# Altium project GE-Switch.PrjPCB
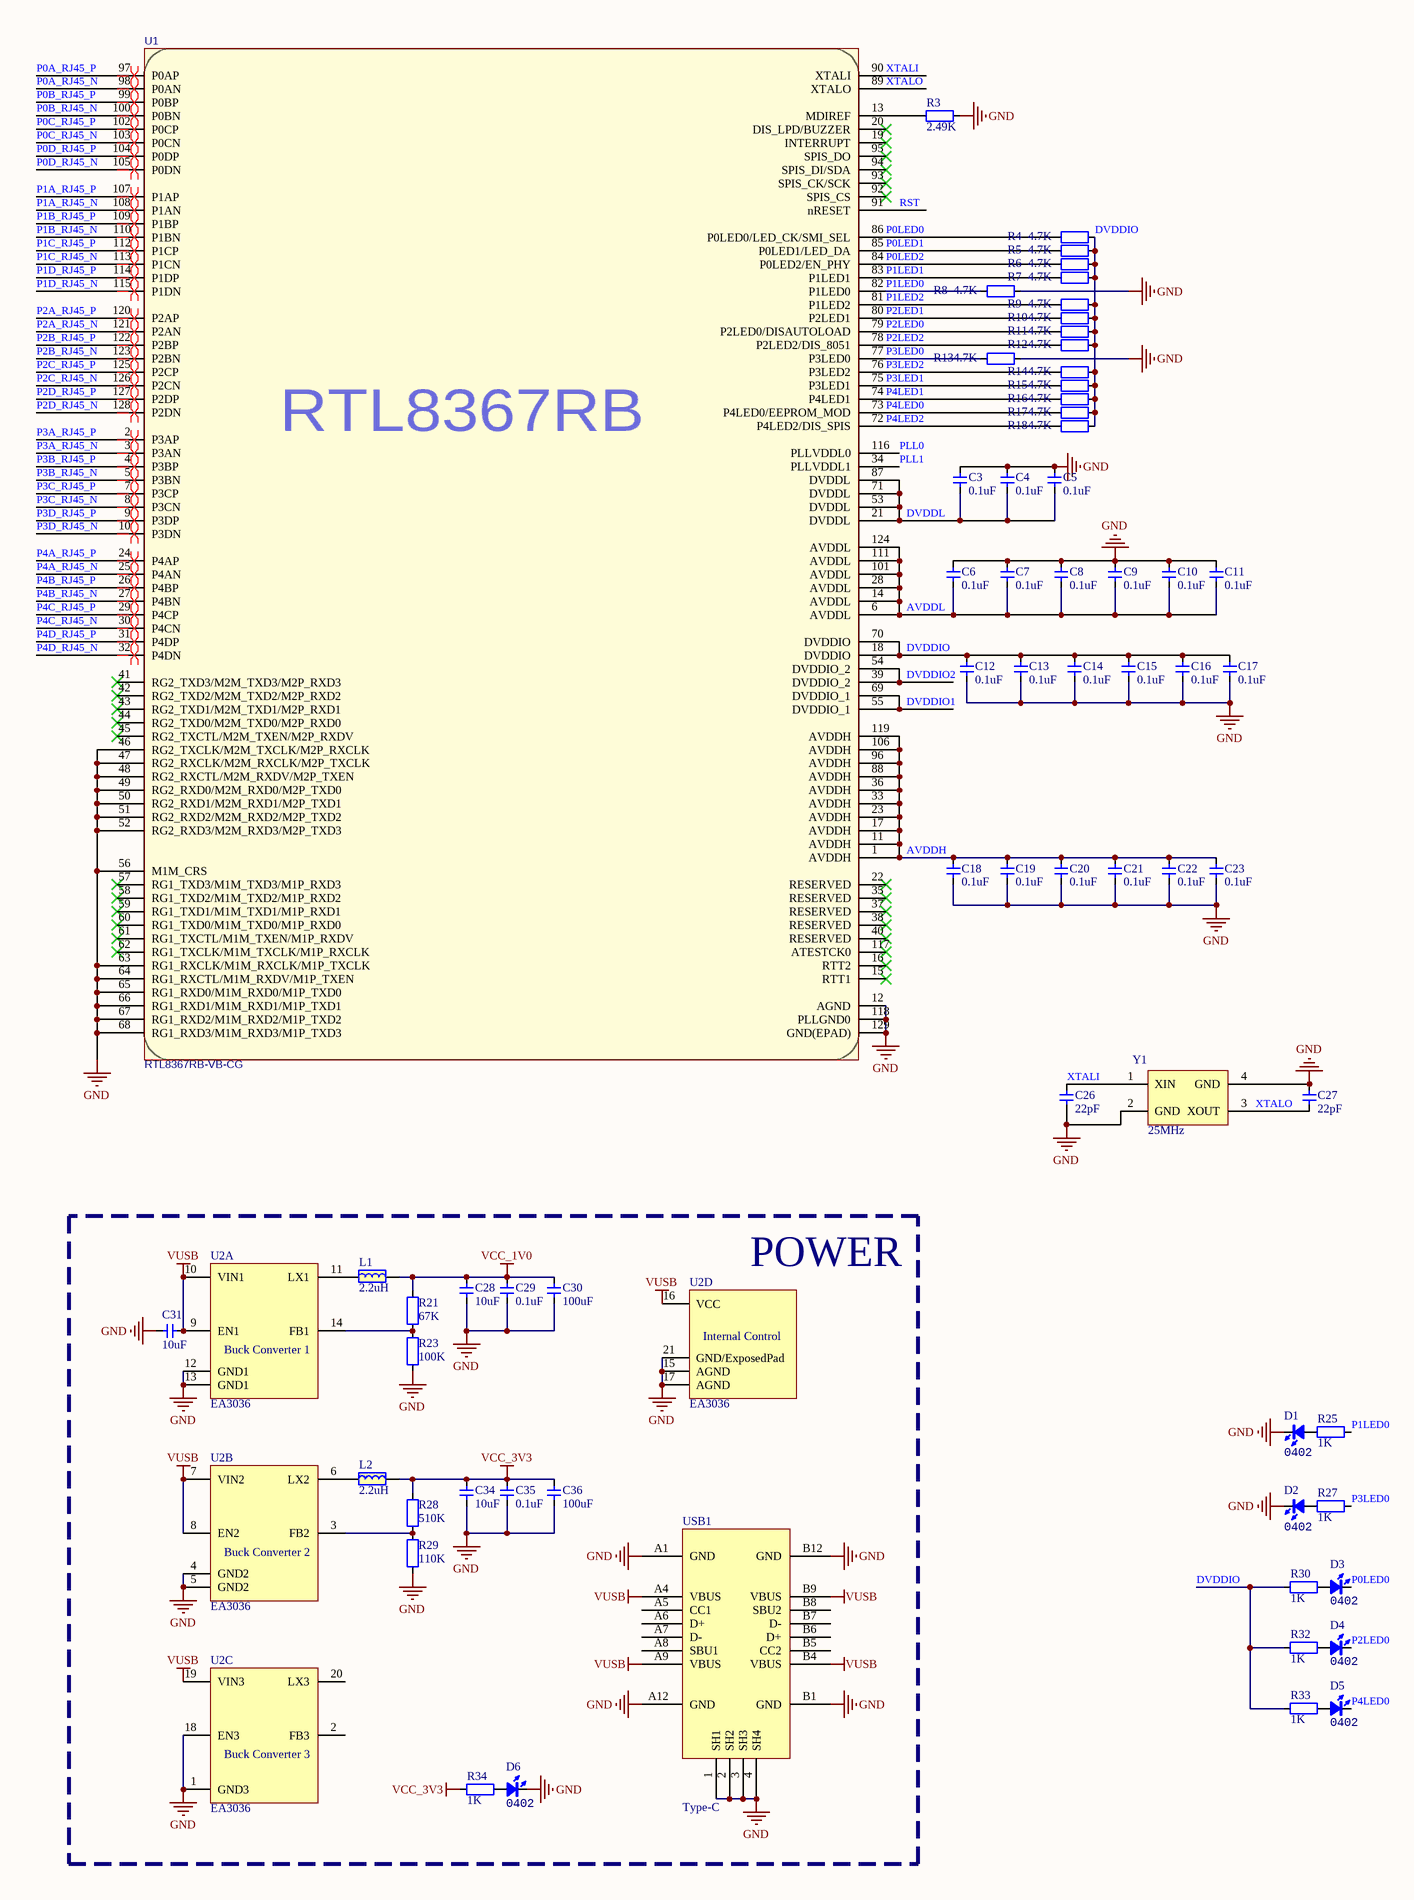
[diagram p0: Main.SchDoc, left]
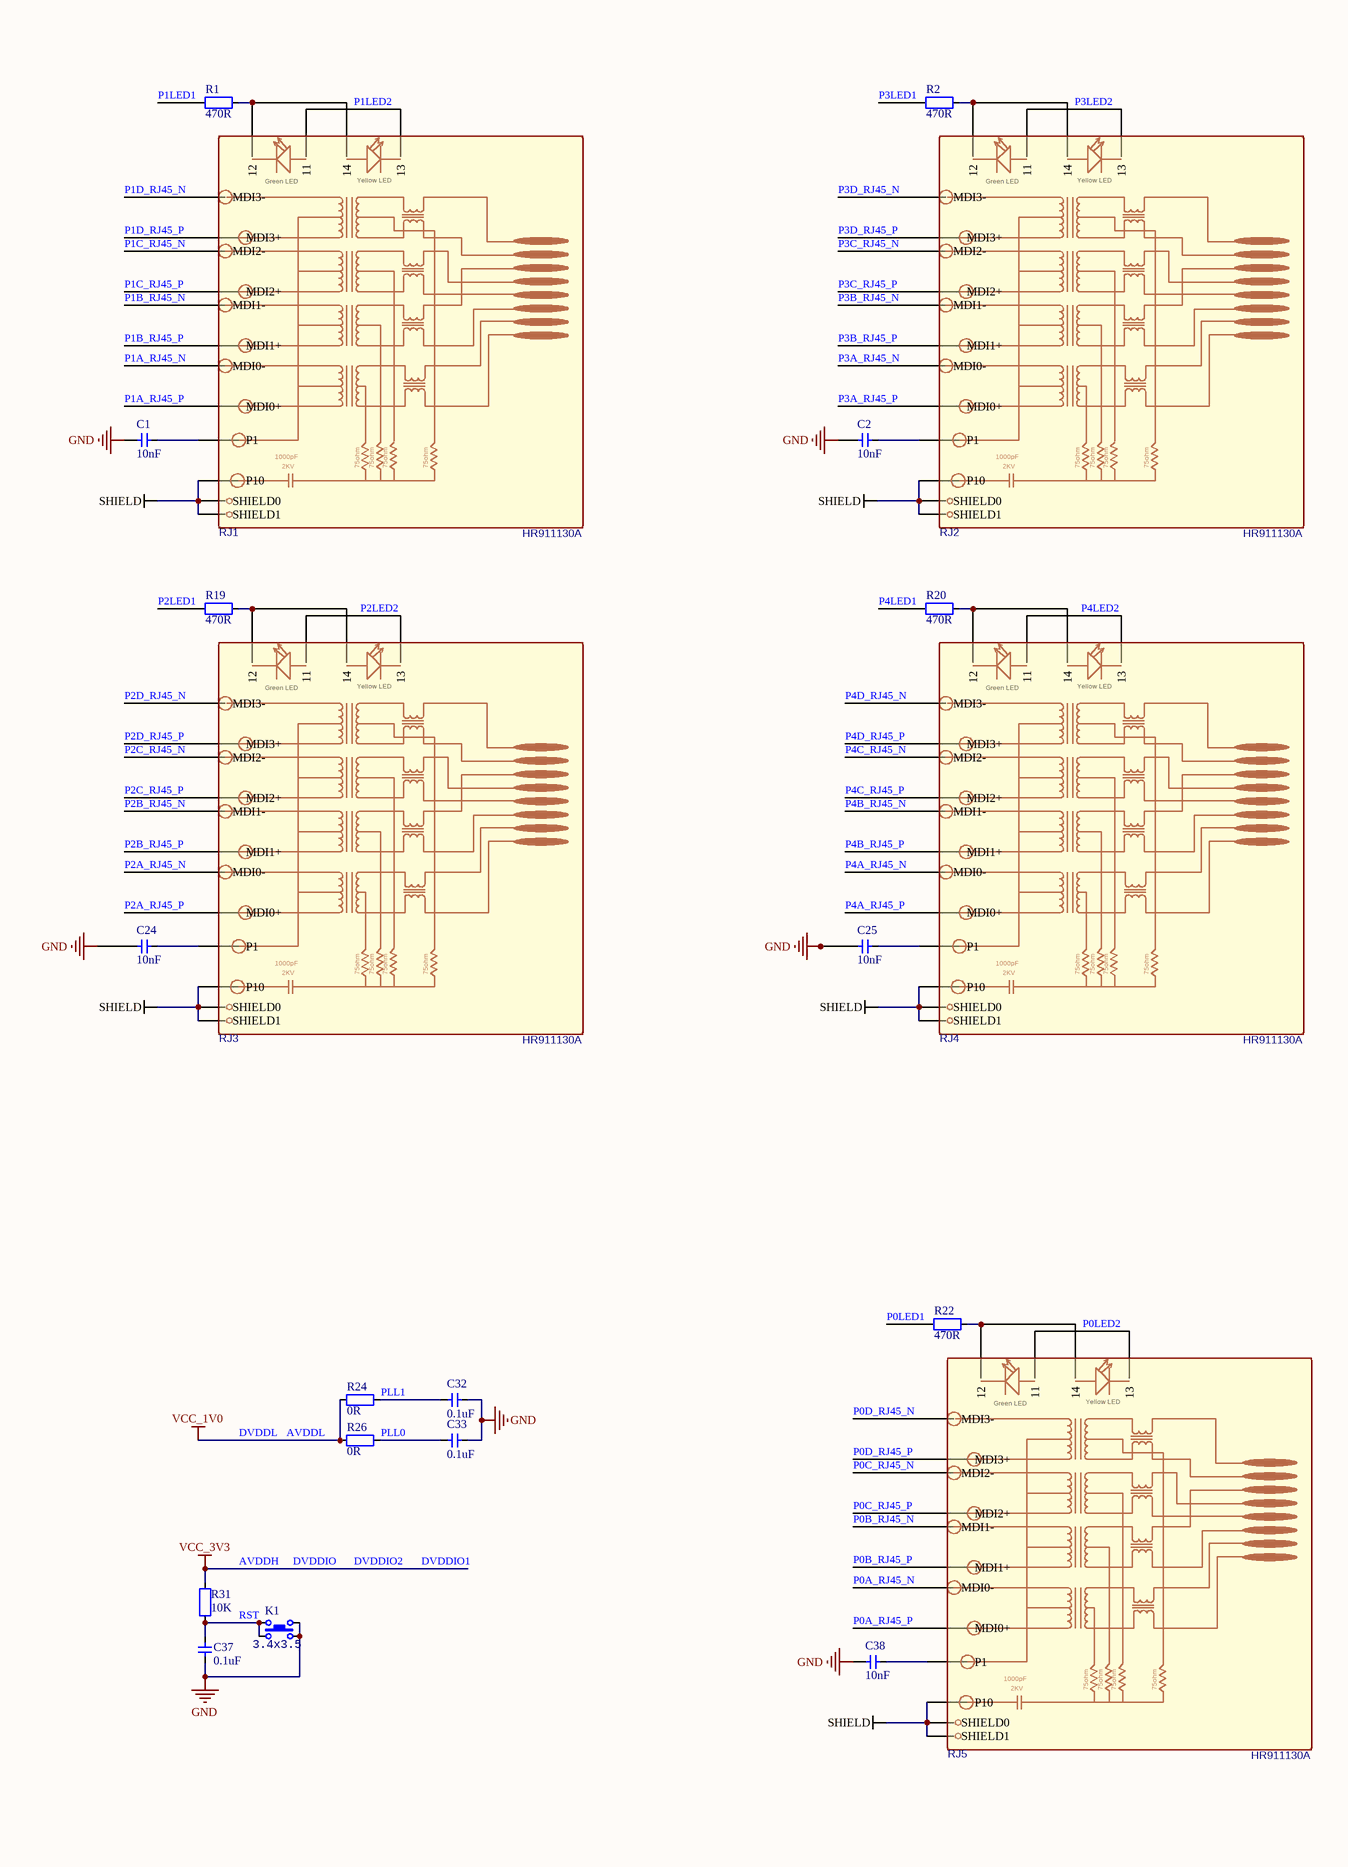
[diagram p1: Main.SchDoc, right]
1 sheet, 90 parts. Net scope: global (net labels, ports and power ports of the same name join across sheets).
Board file: GE-Switch.PcbDoc

## Sheet Main.SchDoc
size A2; SheetNumber: 1; SheetTotal: 1

### Parts
C1  10nF  [CAP_0402]
C2  10nF  [CAP_0402]
C3  0.1uF  [CAP_0402]
C4  0.1uF  [CAP_0402]
C5  0.1uF  [CAP_0402]
C6  0.1uF  [CAP_0402]
C7  0.1uF  [CAP_0402]
C8  0.1uF  [CAP_0402]
C9  0.1uF  [CAP_0402]
C10  0.1uF  [CAP_0402]
C11  0.1uF  [CAP_0402]
C12  0.1uF  [CAP_0402]
C13  0.1uF  [CAP_0402]
C14  0.1uF  [CAP_0402]
C15  0.1uF  [CAP_0402]
C16  0.1uF  [CAP_0402]
C17  0.1uF  [CAP_0402]
C18  0.1uF  [CAP_0402]
C19  0.1uF  [CAP_0402]
C20  0.1uF  [CAP_0402]
C21  0.1uF  [CAP_0402]
C22  0.1uF  [CAP_0402]
C23  0.1uF  [CAP_0402]
C24  10nF  [CAP_0402]
C25  10nF  [CAP_0402]
C26  22pF  [CAP_0402]
C27  22pF  [CAP_0402]
C28  10uF  [CAP_0402]
C29  0.1uF  [CAP_0402]
C30  100uF  [1206-CAP]
C31  10uF  [CAP_0402]
C32  0.1uF  [CAP_0402]
C33  0.1uF  [CAP_0402]
C34  10uF  [CAP_0402]
C35  0.1uF  [CAP_0402]
C36  100uF  [1206-CAP]
C37  0.1uF  [CAP_0402]
C38  10nF  [CAP_0402]
D1  Type: 0402  [LED_0402_RED]  (hidden comment: color?)
D2  Type: 0402  [LED_0402_RED]  (hidden comment: color?)
D3  Type: 0402  [LED_0402_RED]  (hidden comment: color?)
D4  Type: 0402  [LED_0402_RED]  (hidden comment: color?)
D5  Type: 0402  [LED_0402_RED]  (hidden comment: color?)
D6  Type: 0402  [LED_0402_RED]  (hidden comment: color?)
K1  value 3.4x3.5  [ButtonTACT_3.5*3.55_90]  (hidden comment: TACT 4P)
L1  2.2uH  [2520-L]
L2  2.2uH  [2520-L]
R1  470R  [RES_0402]
R2  470R  [RES_0402]
R3  2.49K  [RES_0402]
R4  4.7K  [RES_0402]
R5  4.7K  [RES_0402]
R6  4.7K  [RES_0402]
R7  4.7K  [RES_0402]
R8  4.7K  [RES_0402]
R9  4.7K  [RES_0402]
R10  4.7K  [RES_0402]
R11  4.7K  [RES_0402]
R12  4.7K  [RES_0402]
R13  4.7K  [RES_0402]
R14  4.7K  [RES_0402]
R15  4.7K  [RES_0402]
R16  4.7K  [RES_0402]
R17  4.7K  [RES_0402]
R18  4.7K  [RES_0402]
R19  470R  [RES_0402]
R20  470R  [RES_0402]
R21  67K  [RES_0402]
R22  470R  [RES_0402]
R23  100K  [RES_0402]
R24  0R  [RES_0402]
R25  1K  [RES_0402]
R26  0R  [RES_0402]
R27  1K  [RES_0402]
R28  510K  [RES_0402]
R29  110K  [RES_0402]
R30  1K  [RES_0402]
R31  10K  [RES_0402]
R32  1K  [RES_0402]
R33  1K  [RES_0402]
R34  1K  [RES_0402]
RJ1  HR911130A  [RJ45-TH_HR911130A]
RJ2  HR911130A  [RJ45-TH_HR911130A]
RJ3  HR911130A  [RJ45-TH_HR911130A]
RJ4  HR911130A  [RJ45-TH_HR911130A]
RJ5  HR911130A  [RJ45-TH_HR911130A]
U1  RTL8367RB-VB-CG  [LQFP-128]
U2  EA3036  [QFN-20]  (parts A,B,C,D of 4)
USB1  Type-C  [Type-C-TOP]
Y1  25MHz  [晶振2520]

### Blocks framed on the sheet
POWER: C28-C31 C34-C36 D6 L1 L2 R21 R23 R28 R29 R34 U2 USB1

### Nets
AVDDH: C12.1 C13.1 C14.1 C15.1 C16.1 C17.1 C18.1 C19.1 C20.1 C21.1 C22.1 C23.1 C34.1 C35.1 C36.2 L2.2 R4.2 R5.2 R6.2 R7.2 R9.2 R10.2 R11.2 R12.2 R14.2 R15.2 R16.2 R17.2 R18.2 R28.2 R30.1 R31.2 R32.1 R33.1 R34.1 U1.1(AVDDH) U1.11(AVDDH) U1.17(AVDDH) U1.18(DVDDIO) U1.23(AVDDH) U1.33(AVDDH) U1.36(AVDDH) U1.39(DVDDIO_2) U1.54(DVDDIO_2) U1.55(DVDDIO_1) U1.69(DVDDIO_1) U1.70(DVDDIO) U1.88(AVDDH) U1.96(AVDDH) U1.106(AVDDH) U1.119(AVDDH)  [also labelled DVDDIO, DVDDIO1, DVDDIO2, VCC_3V3]
AVDDL: C3.2 C4.2 C5.2 C6.2 C7.2 C8.2 C9.2 C10.2 C11.2 C28.1 C29.1 C30.2 L1.2 R21.2 R24.2 R26.2 U1.6(AVDDL) U1.14(AVDDL) U1.21(DVDDL) U1.28(AVDDL) U1.53(DVDDL) U1.71(DVDDL) U1.87(DVDDL) U1.101(AVDDL) U1.111(AVDDL) U1.124(AVDDL)  [also labelled DVDDL, VCC_1V0]
GND: C1.1 C2.1 C3.1 C4.1 C5.1 C6.1 C7.1 C8.1 C9.1 C10.1 C11.1 C12.2 C13.2 C14.2 C15.2 C16.2 C17.2 C18.2 C19.2 C20.2 C21.2 C22.2 C23.2 C24.1 C25.1 C26.1 C27.1 C28.2 C29.2 C30.1 C31.1 C32.2 C33.2 C34.2 C35.2 C36.1 C37.2 C38.1 D1.2(K) D2.2(K) D6.2(K) K1.2 K1.4 R3.2 R8.2 R13.2 R23.1 R29.1 U1.12(AGND) U1.46(RG2_TXCLK/M2M_TXCLK/M2P_RXCLK) U1.47(RG2_RXCLK/M2M_RXCLK/M2P_TXCLK) U1.48(RG2_RXCTL/M2M_RXDV/M2P_TXEN) U1.49(RG2_RXD0/M2M_RXD0/M2P_TXD0) U1.50(RG2_RXD1/M2M_RXD1/M2P_TXD1) U1.51(RG2_RXD2/M2M_RXD2/M2P_TXD2) U1.52(RG2_RXD3/M2M_RXD3/M2P_TXD3) U1.56(M1M_CRS) U1.63(RG1_RXCLK/M1M_RXCLK/M1P_TXCLK) U1.64(RG1_RXCTL/M1M_RXDV/M1P_TXEN) U1.65(RG1_RXD0/M1M_RXD0/M1P_TXD0) U1.66(RG1_RXD1/M1M_RXD1/M1P_TXD1) U1.67(RG1_RXD2/M1M_RXD2/M1P_TXD2) U1.68(RG1_RXD3/M1M_RXD3/M1P_TXD3) U1.118(PLLGND0) U1.129(GND(EPAD)) U2.1(GND3) U2.4(GND2) U2.5(GND2) U2.12(GND1) U2.13(GND1) U2.15(AGND) U2.17(AGND) U2.18(EN3) U2.21(GND/ExposedPad) USB1.1(SH1) USB1.2(SH2) USB1.3(SH3) USB1.4(SH4) USB1.A1(GND) USB1.A12(GND) USB1.B1(GND) USB1.B12(GND) Y1.2(GND) Y1.4(GND)
SHIELD: RJ1.P10 RJ1.SHIELD0 RJ1.SHIELD1 RJ2.P10 RJ2.SHIELD0 RJ2.SHIELD1 RJ3.P10 RJ3.SHIELD0 RJ3.SHIELD1 RJ4.P10 RJ4.SHIELD0 RJ4.SHIELD1 RJ5.P10 RJ5.SHIELD0 RJ5.SHIELD1
VUSB: C31.2 U2.7(VIN2) U2.8(EN2) U2.9(EN1) U2.10(VIN1) U2.16(VCC) U2.19(VIN3) USB1.A4(VBUS) USB1.A9(VBUS) USB1.B4(VBUS) USB1.B9(VBUS)
P0A_RJ45_N: RJ5.P3(MDI0-) U1.98(P0AN)
P0A_RJ45_P: RJ5.P2(MDI0+) U1.97(P0AP)
P0B_RJ45_N: RJ5.P7(MDI1-) U1.100(P0BN)
P0B_RJ45_P: RJ5.P4(MDI1+) U1.99(P0BP)
P0C_RJ45_N: RJ5.P6(MDI2-) U1.103(P0CN)
P0C_RJ45_P: RJ5.P5(MDI2+) U1.102(P0CP)
P0D_RJ45_N: RJ5.P9(MDI3-) U1.105(P0DN)
P0D_RJ45_P: RJ5.P8(MDI3+) U1.104(P0DP)
P0LED0: D3.2(K) R4.1 U1.86(P0LED0/LED_CK/SMI_SEL)
P0LED1: R5.1 R22.1 U1.85(P0LED1/LED_DA)
P0LED2: R6.1 RJ5.11 RJ5.13 U1.84(P0LED2/EN_PHY)
P1A_RJ45_N: RJ1.P3(MDI0-) U1.108(P1AN)
P1A_RJ45_P: RJ1.P2(MDI0+) U1.107(P1AP)
P1B_RJ45_N: RJ1.P7(MDI1-) U1.110(P1BN)
P1B_RJ45_P: RJ1.P4(MDI1+) U1.109(P1BP)
P1C_RJ45_N: RJ1.P6(MDI2-) U1.113(P1CN)
P1C_RJ45_P: RJ1.P5(MDI2+) U1.112(P1CP)
P1D_RJ45_N: RJ1.P9(MDI3-) U1.115(P1DN)
P1D_RJ45_P: RJ1.P8(MDI3+) U1.114(P1DP)
P1LED0: R8.1 R25.1 U1.82(P1LED0)
P1LED1: R1.1 R7.1 U1.83(P1LED1)
P1LED2: R9.1 RJ1.11 RJ1.13 U1.81(P1LED2)
P2A_RJ45_N: RJ3.P3(MDI0-) U1.121(P2AN)
P2A_RJ45_P: RJ3.P2(MDI0+) U1.120(P2AP)
P2B_RJ45_N: RJ3.P7(MDI1-) U1.123(P2BN)
P2B_RJ45_P: RJ3.P4(MDI1+) U1.122(P2BP)
P2C_RJ45_N: RJ3.P6(MDI2-) U1.126(P2CN)
P2C_RJ45_P: RJ3.P5(MDI2+) U1.125(P2CP)
P2D_RJ45_N: RJ3.P9(MDI3-) U1.128(P2DN)
P2D_RJ45_P: RJ3.P8(MDI3+) U1.127(P2DP)
P2LED0: D4.2(K) R11.1 U1.79(P2LED0/DISAUTOLOAD)
P2LED1: R10.1 R19.1 U1.80(P2LED1)
P2LED2: R12.1 RJ3.11 RJ3.13 U1.78(P2LED2/DIS_8051)
P3A_RJ45_N: RJ2.P3(MDI0-) U1.3(P3AN)
P3A_RJ45_P: RJ2.P2(MDI0+) U1.2(P3AP)
P3B_RJ45_N: RJ2.P7(MDI1-) U1.5(P3BN)
P3B_RJ45_P: RJ2.P4(MDI1+) U1.4(P3BP)
P3C_RJ45_N: RJ2.P6(MDI2-) U1.8(P3CN)
P3C_RJ45_P: RJ2.P5(MDI2+) U1.7(P3CP)
P3D_RJ45_N: RJ2.P9(MDI3-) U1.10(P3DN)
P3D_RJ45_P: RJ2.P8(MDI3+) U1.9(P3DP)
P3LED0: R13.1 R27.1 U1.77(P3LED0)
P3LED1: R2.1 R15.1 U1.75(P3LED1)
P3LED2: R14.1 RJ2.11 RJ2.13 U1.76(P3LED2)
P4A_RJ45_N: RJ4.P3(MDI0-) U1.25(P4AN)
P4A_RJ45_P: RJ4.P2(MDI0+) U1.24(P4AP)
P4B_RJ45_N: RJ4.P7(MDI1-) U1.27(P4BN)
P4B_RJ45_P: RJ4.P4(MDI1+) U1.26(P4BP)
P4C_RJ45_N: RJ4.P6(MDI2-) U1.30(P4CN)
P4C_RJ45_P: RJ4.P5(MDI2+) U1.29(P4CP)
P4D_RJ45_N: RJ4.P9(MDI3-) U1.32(P4DN)
P4D_RJ45_P: RJ4.P8(MDI3+) U1.31(P4DP)
P4LED0: D5.2(K) R17.1 U1.73(P4LED0/EEPROM_MOD)
P4LED1: R16.1 R20.1 U1.74(P4LED1)
P4LED2: R18.1 RJ4.11 RJ4.13 U1.72(P4LED2/DIS_SPIS)
PLL0: C33.1 R26.1 U1.116(PLLVDDL0)
PLL1: C32.1 R24.1 U1.34(PLLVDDL1)
RST: C37.1 K1.1 K1.3 R31.1 U1.91(nRESET)
XTALI: C26.2 U1.90(XTALI) Y1.1(XIN)
XTALO: C27.2 U1.89(XTALO) Y1.3(XOUT)
NetC1_2: C1.2 RJ1.P1
NetC2_2: C2.2 RJ2.P1
NetC24_2: C24.2 RJ3.P1
NetC25_2: C25.2 RJ4.P1
NetC38_2: C38.2 RJ5.P1
NetD1_1: D1.1(A) R25.2
NetD2_1: D2.1(A) R27.2
NetD3_1: D3.1(A) R30.2
NetD4_1: D4.1(A) R32.2
NetD5_1: D5.1(A) R33.2
NetD6_1: D6.1(A) R34.2
NetL1_1: L1.1 U2.11(LX1)
NetL2_1: L2.1 U2.6(LX2)
NetR1_2: R1.2 RJ1.12 RJ1.14
NetR2_2: R2.2 RJ2.12 RJ2.14
NetR3_1: R3.1 U1.13(MDIREF)
NetR19_2: R19.2 RJ3.12 RJ3.14
NetR20_2: R20.2 RJ4.12 RJ4.14
NetR21_1: R21.1 R23.2 U2.14(FB1)
NetR22_2: R22.2 RJ5.12 RJ5.14
NetR28_1: R28.1 R29.2 U2.3(FB2)

Not connected (* = marked no-connect by the designer): U1 15(RTT1)* 16(RTT2)* 19(INTERRUPT)* 20(DIS_LPD/BUZZER)* 22(RESERVED)* 35(RESERVED)* 37(RESERVED)* 38(RESERVED)* 40(RESERVED)* 41(RG2_TXD3/M2M_TXD3/M2P_RXD3)* 42(RG2_TXD2/M2M_TXD2/M2P_RXD2)* 43(RG2_TXD1/M2M_TXD1/M2P_RXD1)* 44(RG2_TXD0/M2M_TXD0/M2P_RXD0)* 45(RG2_TXCTL/M2M_TXEN/M2P_RXDV)* 57(RG1_TXD3/M1M_TXD3/M1P_RXD3)* 58(RG1_TXD2/M1M_TXD2/M1P_RXD2)* 59(RG1_TXD1/M1M_TXD1/M1P_RXD1)* 60(RG1_TXD0/M1M_TXD0/M1P_RXD0)* 61(RG1_TXCTL/M1M_TXEN/M1P_RXDV)* 62(RG1_TXCLK/M1M_TXCLK/M1P_RXCLK)* 92(SPIS_CS)* 93(SPIS_CK/SCK)* 94(SPIS_DI/SDA)* 95(SPIS_DO)* 117(ATESTCK0)*; U2 2(FB3) 20(LX3); USB1 A5(CC1) A6(D+) A7(D-) A8(SBU1) B5(CC2) B6(D+) B7(D-) B8(SBU2)

### Layout directives
differential pair: P0A_RJ45_N, P0A_RJ45_P, P0B_RJ45_N, P0B_RJ45_P, P0C_RJ45_N, P0C_RJ45_P, P0D_RJ45_N, P0D_RJ45_P, P1A_RJ45_N, P1A_RJ45_P, P1B_RJ45_N, P1B_RJ45_P, P1C_RJ45_N, P1C_RJ45_P, P1D_RJ45_N, P1D_RJ45_P, P2A_RJ45_N, P2A_RJ45_P, P2B_RJ45_N, P2B_RJ45_P, P2C_RJ45_N, P2C_RJ45_P, P2D_RJ45_N, P2D_RJ45_P, P3A_RJ45_N, P3A_RJ45_P, P3B_RJ45_N, P3B_RJ45_P, P3C_RJ45_N, P3C_RJ45_P, P3D_RJ45_N, P3D_RJ45_P, P4A_RJ45_N, P4A_RJ45_P, P4B_RJ45_N, P4B_RJ45_P, P4C_RJ45_N, P4C_RJ45_P, P4D_RJ45_N, P4D_RJ45_P

### Notes on the sheet
- (in symbol EA3036, part A) Buck Converter 1
- (in symbol EA3036, part B) Buck Converter 2
- (in symbol EA3036, part C) Buck Converter 3
- (in symbol EA3036, part D) Internal Control
- (in symbol HR911130A) Yellow LED; Green LED; J8; J7; J6 RX-; J5; J4; J3 RX+; J2 TX-; J1 TX+; 1000pF; 75ohm; 2KV
- (in symbol RTL8367RB-VB-CG) RTL8367RB

### Library data of the parts
C1-C29 C31-C35 C37 C38 = 电容-0402: Capacitor; Value: 0.1u
C30 C36 = 电容-1206: Capacitor; Value: 0.1u
D1-D6 = LED_0402: LED; Value: color?
K1 = ButtonTACT: Button; type: TACT 4P
L1 L2 = 电感-2520: 磁珠
R1-R34 = 电阻-0402: Resistor; Value: 22R
RJ1-RJ5 = HR911130A: BOM_Manufacturer: HANRUN; BOM_Supplier: LCSC; BOM_Manufacturer Part: HR911130A; BOM_Supplier Part: C54408; spicePre: R; spiceSymbolName: HR911130A
U1 = RTL8367RB-VB-CG: Contributor: libc0607; link: https://www.realtek.com/en/products/communications-network-ics/item/rtl8367rb-vb-cg; spicePre: U; spiceSymbolName: RTL8367RB-VB-CG
U2 = EA3036: EA3036 is a 3CH power management IC for applications powered by one Li-Ion battery or a DC 5V adapter.
USB1 = USB-Type-C-TOP
Y1 = 晶振-4Pin-无源: 2520无源; MF: ECS International; MP: ECS-3225S30-240-EN-TR; Package: SMD-6 ECS International; Price: 0.75 USD; Availability: Unavailable; Value: *